# Altium schematic sheet Sensor Board.SchDoc
size 420 x 297 mm; Date: 15.01.2024; CheckedBy: Arda B; DrawnBy: Arda Bozkurt; DocumentNumber: 5; Revision: 001; SheetNumber: 5; SheetTotal: 5; Department: HDD; Size: A3
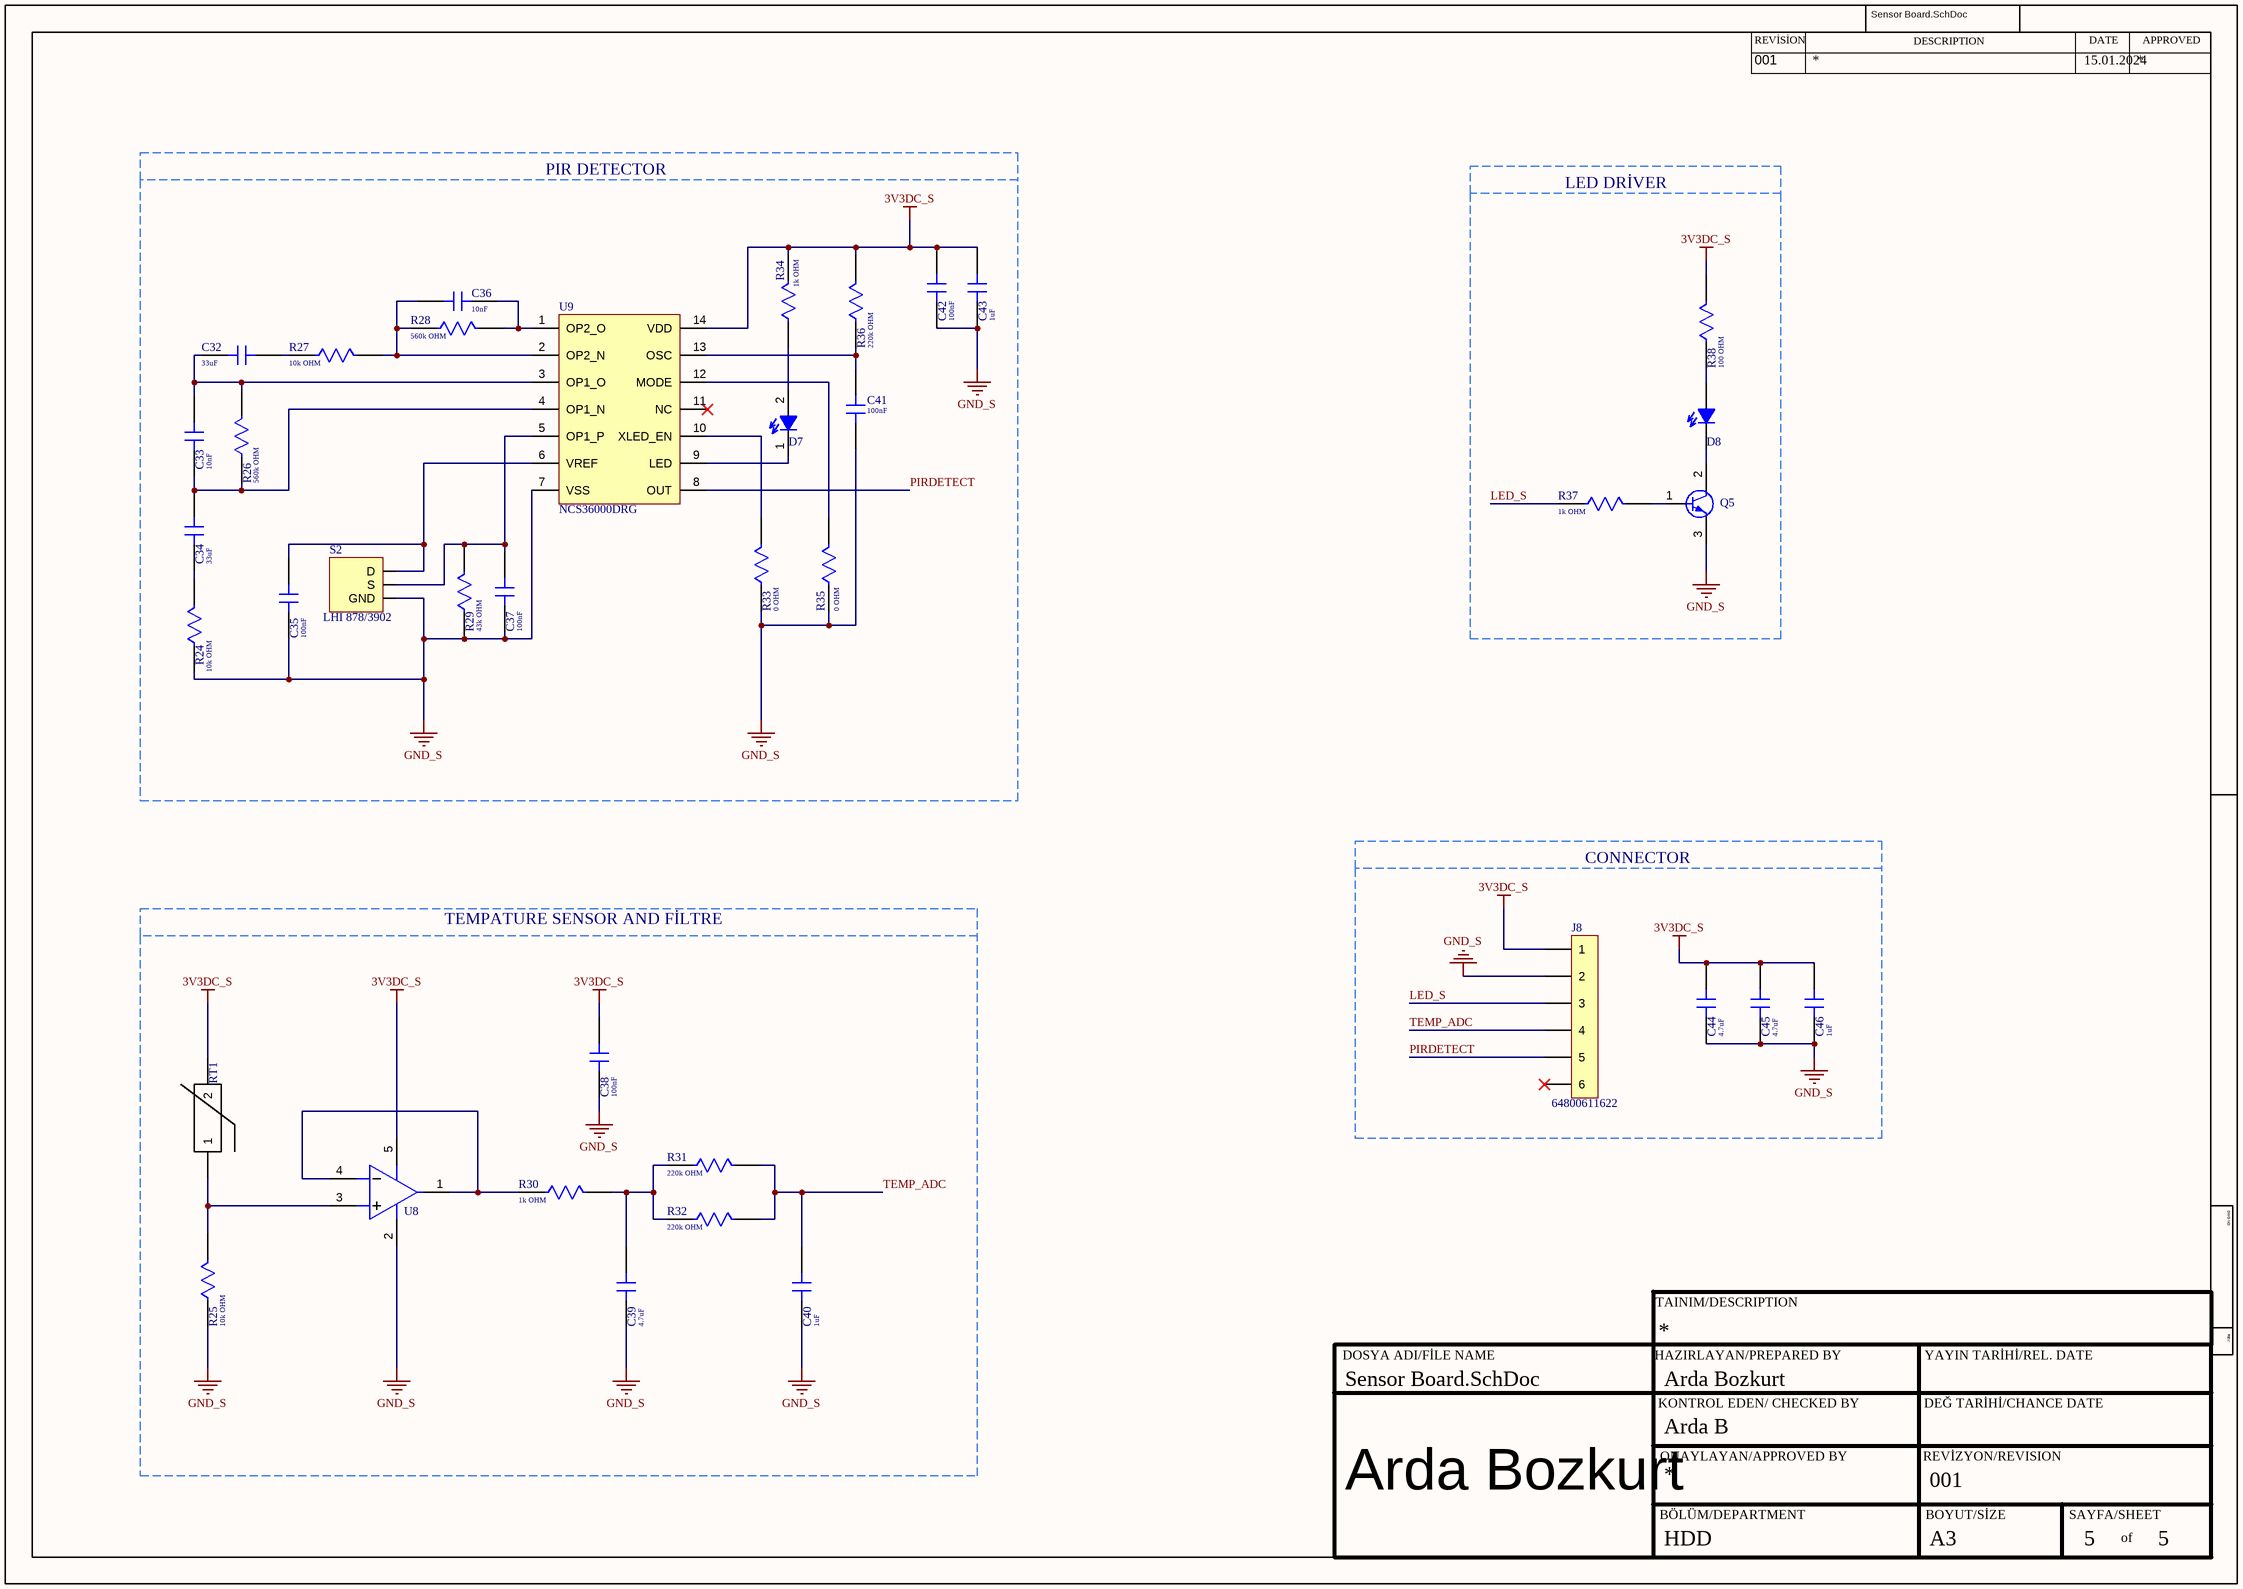
[diagram p0: Sensor Board.SchDoc]

## Parts
C32  value 33uF  [CAP 1206]  (hidden comment: C3216X5R1C336M160AB)
C33  value 10nF  [CAP-0603]  (hidden comment: 0603B103K160CT)
C34  value 33uF  [CAP 1206]  (hidden comment: C3216X5R1C336M160AB)
C35  value 100nF  [CAP-0805]  (hidden comment: 08055C104KAT2A)
C36  value 10nF  [CAP-0603]  (hidden comment: 0603B103K160CT)
C37  value 100nF  [CAP-0805]  (hidden comment: 08055C104KAT2A)
C38  value 100nF  [CAP-0603]  (hidden comment: C0603C104KRACTU)
C39  value 4.7uF  [CAP-0805]  (hidden comment: CL21A475KAQNNNE)
C40  value 1uF  [CAP-0805]  (hidden comment: CL21B105KAFNNNE)
C41  value 100nF  [CAP-0805]  (hidden comment: 08055C104KAT2A)
C42  value 100nF  [CAP-0805]  (hidden comment: 08055C104KAT2A)
C43  value 1uF  [CAP-0805]  (hidden comment: CL21B105KAFNNNE)
C44  value 4.7uF  [CAP-0805]  (hidden comment: CL21A475KAQNNNE)
C45  value 4.7uF  [CAP-0805]  (hidden comment: CL21A475KAQNNNE)
C46  value 1uF  [CAP-0805]  (hidden comment: CL21B105KAFNNNE)
D7  LTST-C171GKT  [LED GREEN 0805]  (value not drawn)
D8  LS R976-NR-1  [LED RED 0805]  (value not drawn)
J8  64800611622  [PİN_HEADER_1X6]
Q5  MMBT3904-7-F  [SOT23-3]  (value not drawn)
R24  value 10k OHM  [RES-0603]  (hidden comment: RC0603FR-0710KL)
R25  value 10k OHM  [RES-0603]  (hidden comment: RC0603FR-0710KL)
R26  value 560k OHM  [RES-0603]  (hidden comment: RMCF0603FT560K)
R27  value 10k OHM  [RES-0603]  (hidden comment: RC0603FR-0710KL)
R28  value 560k OHM  [RES-0603]  (hidden comment: RMCF0603FT560K)
R29  value 43k OHM  [RES-0603]  (hidden comment: RMCF0603FT43K0)
R30  value 1k OHM  [RES-0603]  (hidden comment: RMCF0603FT1K00)
R31  value 220k OHM  [RES-0603]  (hidden comment: WR06X2203FTL)
R32  value 220k OHM  [RES-0603]  (hidden comment: WR06X2203FTL)
R33  value 0 OHM  [RES-0603]  (hidden comment: RMCF0603ZT0R00)
R34  value 1k OHM  [RES-0603]  (hidden comment: RMCF0603FT1K00)
R35  value 0 OHM  [RES-0603]  (hidden comment: RMCF0603ZT0R00)
R36  value 220k OHM  [RES-0603]  (hidden comment: WR06X2203FTL)
R37  value 1k OHM  [RES-0603]  (hidden comment: RMCF0603FT1K00)
R38  value 100 OHM  [RES-0603]  (hidden comment: RMCF0603FT100R)
RT1  TFPT1206L1002FM  [TFPT1206]  (value not drawn)
S2  LHI 878/3902  [TO-5-3]
U8  OPA314AIDBVR  [SOT23-5]  (value not drawn)
U9  NCS36000DRG  [SOIC-14]

## Blocks framed on the sheet
PIR DETECTOR: C32-C37 C41-C43 D7 R24 R26-R29 R33-R36 S2 U9
LED DRİVER: D8 Q5 R37 R38
CONNECTOR: C44-C46 J8
TEMPATURE SENSOR AND FİLTRE: C38-C40 R25 R30-R32 RT1 U8

## Nets
3V3DC_S: C38.2 C42.2 C43.2 C44.2 C45.2 C46.2 J8.1 R34.2 R36.2 R38.2 RT1.2 U8.5(VCC+) U9.14(VDD)
GND_S: C35.1 C37.1 C38.1 C39.1 C40.1 C41.1 C42.1 C43.1 C44.1 C45.1 C46.1 J8.2 Q5.3(E) R24.1 R25.1 R29.1 R33.1 R35.1 S2.3(GND) U8.2(VCC-) U9.7(VSS)
LED_S: J8.3 R37.1
PIRDETECT: J8.5 U9.8(OUT)
TEMP_ADC: C40.2 J8.4 R31.2 R32.2
NetC32_1: C32.1 C33.2 R26.2 U9.3(OP1_O)
NetC32_2: C32.2 R27.1
NetC33_1: C33.1 C34.2 R26.1 U9.4(OP1_N)
NetC34_1: C34.1 R24.2
NetC35_2: C35.2 S2.1(D) U9.6(VREF)
NetC36_1: C36.1 R27.2 R28.1 U9.2(OP2_N)
NetC36_2: C36.2 R28.2 U9.1(OP2_O)
NetC37_2: C37.2 R29.2 S2.2(S) U9.5(OP1_P)
NetC39_2: C39.2 R30.2 R31.1 R32.1
NetC41_2: C41.2 R36.1 U9.13(OSC)
NetD7_1: D7.1 U9.9(LED)
NetD7_2: D7.2 R34.1
NetD8_1: D8.1 Q5.2(C)
NetD8_2: D8.2 R38.1
NetQ5_1: Q5.1(B) R37.2
NetR25_2: R25.2 RT1.1 U8.3(IN+)
NetR30_1: R30.1 U8.1(OUT) U8.4(IN-)
NetR33_2: R33.2 U9.10(XLED_EN)
NetR35_2: R35.2 U9.12(MODE)

Not connected (* = marked no-connect by the designer): J8 6*; U9 11(NC)*

## Notes on the sheet
- REVİSİON
- DESCRIPTION
- DATE
- APPROVED
- DWG NO:
- TAINIM/DESCRIPTION
- REV:
- DOSYA ADI/FİLE NAME
- HAZIRLAYAN/PREPARED BY
- KONTROL EDEN/ CHECKED BY
- YAYIN TARİHİ/REL. DATE
- DEĞ TARİHİ/CHANCE DATE
- ONAYLAYAN/APPROVED BY
- REVİZYON/REVISION
- Arda Bozkurt
- BÖLÜM/DEPARTMENT
- BOYUT/SİZE
- SAYFA/SHEET
- of

## Library data of the parts
C32 C34 = CAP CER 33uF 1206: C Series 1206 33 uF 16 V ±20 % Tolerance X5R SMT Multilayer Ceramic Capacitor; Manufacturer: TDK; Material: 4241ConductorMaterial; Tolerance: 20%; Voltage Rating (DC): 16V; Designed By.: Arda B.; Supplier: Digi-Key; Supplier Part Number: 445-6002-1-ND; Manufacturer Part Number: C3216X5R1C336M160AB; RoHS: Yes; Category: Ceramic Capacitors; Stock: 80093; Pricing: 1=0,97, 10=0,7, 50=0,6118, 100=0,4985, 500=0,40788, 1000=0,35123 (USD); Mounting Technology: Surface Mount; Case/Package: 1206; Dielectric Material: Ceramic; Case Code (Metric): 3216; Case Code (Imperial): 1206; Weight: 0.000571oz; Min Operating Temperature: -55°C; Max Operating Temperature: 85°C; Packaging: Tape and Reel; Dielectric: X5R; Package Quantity: 2000; Voltage Rating: 16V; Termination: SMD/SMT; Series: C; Construction: Flat; Length: 3.2mm; Width: 1.6mm; Height: 1.6mm; Depth: 1.6mm; Radiation Hardening: No; Reach SVHC Compliant: No; Lead Free: Lead Free; RoHS Compliant: Yes; ComponentLink1URL: https://datasheet.ciiva.com/24219/c3216x5r1c336m160ab-265284-24219738.pdf?src-supplier=Mouser; ComponentLink1Description: https://datasheet.ciiva.com/24219/c3216x5r1c336m160ab-265284-24219738.pdf?src-supplier=Mouser; ComponentLink2URL: https://datasheet.ciiva.com/15192/getdatasheetpartid-714446-15192221.pdf?src-supplier=Verical; ComponentLink2Description: https://datasheet.ciiva.com/15192/getdatasheetpartid-714446-15192221.pdf?src-supplier=Verical; ComponentLink3URL: https://datasheet.ciiva.com/6285/tdkmlcccaprange-6285581.pdf?src-supplier=Digi-Key; ComponentLink3Description: https://datasheet.ciiva.com/6285/tdkmlcccaprange-6285581.pdf?src-supplier=Digi-Key; ComponentLink4URL: https://datasheet.ciiva.com/6285/tdkmlcccaprange-6285578.pdf?src-supplier=Digi-Key; ComponentLink4Description: https://datasheet.ciiva.com/6285/tdkmlcccaprange-6285578.pdf?src-supplier=Digi-Key; ComponentLink5URL: https://datasheet.ciiva.com/6285/tdkmlcccaprange-6285583.pdf?src-supplier=Digi-Key; ComponentLink5Description: https://datasheet.ciiva.com/6285/tdkmlcccaprange-6285583.pdf?src-supplier=Digi-Key
C33 C36 = CAP CER 10nF 0603: 0603 16V X7R .01uF 10% multilayer ceramic capacitor; Manufacturer: Walsin Technologies; Designed By: Arda B.; Supplier: Digi-Key; Supplier Part Number: 1292-1384-1-ND; Manufacturer Part Number: 0603B103K160CT; RoHS: Yes; Category: Ceramic Capacitors; Stock: 116602; Pricing: 1=0,1, 10=0,032, 50=0,0182, 100=0,0141, 500=0,0106, 1000=0,00833 (USD); Lead Free: 5697LeadFree; ComponentLink1URL: http://www.farnell.com/datasheets/1958513.pdf?src-supplier=Farnell; ComponentLink1Description: http://www.farnell.com/datasheets/1958513.pdf?src-supplier=Farnell; ComponentLink2URL: http://www.passivecomponent.com/wp-content/uploads/2018/10/MLCC.pdf?src-supplier=Digi-Key; ComponentLink2Description: http://www.passivecomponent.com/wp-content/uploads/2018/10/MLCC.pdf?src-supplier=Digi-Key; ComponentLink3URL: https://datasheet.octopart.com/0603B103K160CT-Walsin-Technologies-datasheet-85392065.pdf?src-supplier=Element14; ComponentLink3Description: https://datasheet.octopart.com/0603B103K160CT-Walsin-Technologies-datasheet-85392065.pdf?src-supplier=Element14; ComponentLink4URL: https://datasheet.octopart.com/0603B103K160CT-Walsin-Technologies-datasheet-136037192.pdf?src-supplier=Future+Electronics; ComponentLink4Description: https://datasheet.octopart.com/0603B103K160CT-Walsin-Technologies-datasheet-136037192.pdf?src-supplier=Future+Electronics; ComponentLink5URL: https://datasheet.octopart.com/0603B103K160CT-Walsin-Technologies-datasheet-62066062.pdf?src-supplier=TME; ComponentLink5Description: https://datasheet.octopart.com/0603B103K160CT-Walsin-Technologies-datasheet-62066062.pdf?src-supplier=TME
C35 C37 C41 C42 = CAP CER 100nF 0805: Multilayer Ceramic Capacitor, 0.1 uF, 50 V, ± 10%, X7R, 0805 [2012 Metric]; Manufacturer: Kyocera AVX; Designed By: Arda B.; Material: 4241ConductorMaterial; Voltage Rating (DC): 50V; Supplier: Arrow Electronics; Supplier Part Number: 08055C104KAT2A; Manufacturer Part Number: 08055C104KAT2A; RoHS: Yes; Category: Ceramic Capacitors; Stock: 4448000; Pricing: 4000=0,0139, 8000=0,0127, 12000=0,0121, 20000=0,012, 24000=0,0115, 100000=0,0076 (USD); Case/Package: 0805; Case Code (Metric): 2012; Case Code (Imperial): 0805; Dielectric Material: Ceramic; Weight: 0.001411oz; Min Operating Temperature: -55°C; Max Operating Temperature: 125°C; Tolerance: 10%; Dielectric: X7R; Packaging: Cut Tape; Package Quantity: 4000; Termination: Standard; Voltage: 50V; Series: MLCC X7R; Voltage Rating (AC): 50V; Length: 2mm; Width: 1.2mm; Height: 0.5mm; Lead Free: Lead Free; RoHS Compliant: Yes; ComponentLink1URL: https://datasheet.ciiva.com/19475/2009691-19475858.pdf?src-supplier=Jameco; ComponentLink1Description: https://datasheet.ciiva.com/19475/2009691-19475858.pdf?src-supplier=Jameco; ComponentLink2URL: https://datasheet.ciiva.com/11786/0900766b802d4698-11786116.pdf?src-supplier=Rs; ComponentLink2Description: https://datasheet.ciiva.com/11786/0900766b802d4698-11786116.pdf?src-supplier=Rs; ComponentLink3URL: https://datasheet.ciiva.com/5416/cx7r-5416959.pdf?src-supplier=Mouser; ComponentLink3Description: https://datasheet.ciiva.com/5416/cx7r-5416959.pdf?src-supplier=Mouser; ComponentLink4URL: https://datasheet.ciiva.com/2988/cx7r-2988014.pdf?src-supplier=Avnet; ComponentLink4Description: https://datasheet.ciiva.com/2988/cx7r-2988014.pdf?src-supplier=Avnet; ComponentLink5URL: https://datasheet.ciiva.com/16199/cx7r-16199014.pdf?src-supplier=Future+Electronics; ComponentLink5Description: https://datasheet.ciiva.com/16199/cx7r-16199014.pdf?src-supplier=Future+Electronics; ComponentLink6URL: https://datasheet.ciiva.com/11504/cx7r-11504044.pdf?src-supplier=Avnet; ComponentLink6Description: https://datasheet.ciiva.com/11504/cx7r-11504044.pdf?src-supplier=Avnet; ComponentLink7URL: https://datasheet.ciiva.com/150/cx7r-150258.pdf?src-supplier=Digi-Key; ComponentLink7Description: https://datasheet.ciiva.com/150/cx7r-150258.pdf?src-supplier=Digi-Key; ComponentLink8URL: https://datasheet.ciiva.com/150/cx7r-150257.pdf?src-supplier=Digi-Key; ComponentLink8Description: https://datasheet.ciiva.com/150/cx7r-150257.pdf?src-supplier=Digi-Key; ComponentLink9URL: https://datasheet.ciiva.com/150/cx7r-150259.pdf?src-supplier=Digi-Key; ComponentLink9Description: https://datasheet.ciiva.com/150/cx7r-150259.pdf?src-supplier=Digi-Key; ComponentLink10URL: https://datasheet.ciiva.com/7812/cx7r-7812079.pdf?src-supplier=Element14; ComponentLink10Description: https://datasheet.ciiva.com/7812/cx7r-7812079.pdf?src-supplier=Element14
C38 = CAP CER 100nF 0603: Capacitor, 0.1UF, 100V, MLCC, 0603;; Manufacturer: KEMET; Manufacturer Part Number: C0603C104K1RACTU; Dielectric: 1511DielectricType; Designed By: Arda B.; Supplier: Digi-Key; Supplier Part Number: 399-C0603C104K1RACTUCT-ND; RoHS: No; Category: Ceramic Capacitors; Stock: 4405; Pricing: 1=0,28, 10=0,185, 50=0,1296, 100=0,1047, 500=0,07782, 1000=0,06808 (USD); Case/Package: 345Case; Voltage Rating (DC): 100V
C39 C44 C45 = CAP CER 4.7uF 0805: Multilayer Ceramic Capacitor, 4.7 uF, 25 V, ± 10%, X5R, 0805 [2012 Metric]; Manufacturer: Samsung; Voltage Rating: 25V; Designed By: Arda B.; Supplier: Digi-Key; Supplier Part Number: 1276-1244-1-ND; Manufacturer Part Number: CL21A475KAQNNNE; RoHS: Yes; Category: Ceramic Capacitors; Stock: 3410220; Pricing: 1=0,1, 10=0,069, 50=0,0414, 100=0,0326, 500=0,02408, 1000=0,01994 (USD); Mounting Technology: Surface Mount; Case/Package: 0805; Case Code (Metric): 2012; Case Code (Imperial): 0805; Material: Ceramic; Min Operating Temperature: -55°C; Max Operating Temperature: 85°C; Packaging: Tape and Reel; Tolerance: 10%; Dielectric: X5R; Voltage Rating (DC): 25V; Series: CL; Construction: Flat; Length: 2mm; Height: 1.25mm; Depth: 1.25mm; Radiation Hardening: No; Lead Free: Lead Free; RoHS Compliant: Yes; ComponentLink1URL: https://datasheet.ciiva.com/25798/cl21a475kaqnnne-25798882.pdf?src-supplier=Digi-Key; ComponentLink1Description: https://datasheet.ciiva.com/25798/cl21a475kaqnnne-25798882.pdf?src-supplier=Digi-Key
C40 C43 C46 = CAP CER 1uF 0805: Multilayer Ceramic Capacitor, 1 uF, 25 V, ± 10%, X7R, 0805 [2012 Metric]; Manufacturer: Samsung; Voltage: 25V; Designed By: Arda B.; Supplier: Digi-Key; Supplier Part Number: 1276-1066-6-ND; Manufacturer Part Number: CL21B105KAFNNNE; RoHS: Yes; Category: Ceramic Capacitors; Stock: 1108684; Pricing: 1=0,1, 10=0,062, 50=0,0356, 100=0,0276, 500=0,02078, 1000=0,01633 (USD); Mounting Technology: Surface Mount; Case/Package: 0805; Case Code (Metric): 2012; Case Code (Imperial): 0805; Min Operating Temperature: -55°C; Max Operating Temperature: 125°C; Tolerance: 10%; Dielectric: X7R; Voltage Rating (DC): 25V; Series: CL; Packaging: Tape and Reel; Voltage Rating: 25V; Package Quantity: 1; Construction: Flat; Length: 2mm; Width: 0.049inch; Height: 1.25mm; Depth: 1.25mm; Thickness: 0.053inch; Radiation Hardening: No; Lead Free: Lead Free; RoHS Compliant: Yes; ComponentLink1URL: https://datasheet.ciiva.com/25800/cl21b105kafnnne-25800163.pdf?src-supplier=Digi-Key; ComponentLink1Description: https://datasheet.ciiva.com/25800/cl21b105kafnnne-25800163.pdf?src-supplier=Digi-Key; ComponentLink2URL: https://datasheet.ciiva.com/15195/getdatasheetpartid-355205-15195880.pdf?src-supplier=Verical; ComponentLink2Description: https://datasheet.ciiva.com/15195/getdatasheetpartid-355205-15195880.pdf?src-supplier=Verical
D7 = LED GREEN 0805: LED Low-Power Uni-Color Green 565nm 2.1V 2-Pin Chip LED T/R; Manufacturer: Vishay Lite-On; Designed By: Arda B.; Lens Color: Colorless; Viewing Angle: 130°; Lens Style: Flat,Diffused,Colorless,Rectangular,Clear; Luminous Intensity: 12mcd; Forward Current: 30mA; Power Rating: 100mW; Dominant Wavelength: 569nm; Test Current: 10mA; Lens Transparency: Clear; Number of Elements: 1; Reverse Voltage: 5V; Lens Size: 1.25mm; Supplier: Digi-Key; Supplier Part Number: 160-1423-1-ND; Manufacturer Part Number: LTST-C171GKT; RoHS: Yes; Category: LEDs; Stock: 371262; Pricing: 1=0,25, 10=0,136, 100=0,063, 500=0,05818, 1000=0,04557 (USD); Mounting Technology: Surface Mount; Case/Package: 0805; Pins: 2; Color: Green; Case Code (Metric): 2012; Case Code (Imperial): 0805; Min Operating Temperature: -55°C; Max Operating Temperature: 85°C; Package Quantity: 3000; Packaging: Tape and Reel; Forward Voltage: 2.1V; Illumination Color: Green; Power Dissipation: 100mW; Wavelength: 565nm; Number of LEDs: 1; Series: -; Length: 2mm; Width: 1.25mm; Height: 0.9mm; Depth: 1.25mm; Radiation Hardening: No; Lead Free: Lead Free; RoHS Compliant: Yes; ComponentLink1URL: https://datasheet.ciiva.com/2110/ltst-c171gkt-2110000.pdf?src-supplier=Digi-Key; ComponentLink1Description: https://datasheet.ciiva.com/2110/ltst-c171gkt-2110000.pdf?src-supplier=Digi-Key; ComponentLink2URL: https://datasheet.ciiva.com/11773/0900766b80dc0296-11773991.pdf?src-supplier=Rs; ComponentLink2Description: https://datasheet.ciiva.com/11773/0900766b80dc0296-11773991.pdf?src-supplier=Rs; ComponentLink3URL: https://datasheet.ciiva.com/12400/lite-on-ltst-c171gkt-190133-12400647.pdf?src-supplier=Mouser; ComponentLink3Description: https://datasheet.ciiva.com/12400/lite-on-ltst-c171gkt-190133-12400647.pdf?src-supplier=Mouser; ComponentLink4URL: https://datasheet.ciiva.com/2110/ltst-c171gkt-2110001.pdf?src-supplier=Digi-Key; ComponentLink4Description: https://datasheet.ciiva.com/2110/ltst-c171gkt-2110001.pdf?src-supplier=Digi-Key; ComponentLink5URL: https://datasheet.ciiva.com/2110/ltst-c171gkt-2110002.pdf?src-supplier=Digi-Key; ComponentLink5Description: https://datasheet.ciiva.com/2110/ltst-c171gkt-2110002.pdf?src-supplier=Digi-Key; ComponentLink6URL: https://datasheet.ciiva.com/16396/ltst-c171gkt-16396549.pdf?src-supplier=Future+Electronics; ComponentLink6Description: https://datasheet.ciiva.com/16396/ltst-c171gkt-16396549.pdf?src-supplier=Future+Electronics
D8 = LED RED 0805: LED Uni-Color Super Red 645nm 2-Pin Chip 0805(2012Metric) T/R; Manufacturer: Osram Opto; Designed By: Arda B.; Lens Color: White; Viewing Angle: 160°; Lens Style: Flat,Diffused,Colorless,Rectangular; Dominant Wavelength: 633nm; Luminous Flux: 0.47lm; Number of LEDs: 1; Forward Current: 25mA; Forward Voltage: 2.5V; Luminous Intensity: 180mcd; Test Current: 20mA; Power Dissipation: 65mW; Reverse Voltage: 12V; Lens Transparency: Diffused; Lens Size: 1.25mm; Supplier: Digi-Key; Supplier Part Number: 475-LSR976-NR-1CT-ND; Manufacturer Part Number: LSR976-NR-1; RoHS: Yes; Category: LEDs; Stock: 164692; Pricing: 1=0,27, 10=0,147, 100=0,0683, 500=0,06302, 1000=0,04937, 2000=0,04832 (USD); Mounting Technology: Surface Mount; Case/Package: 0805; Pins: 2; Color: Red; Case Code (Metric): 2012; Case Code (Imperial): 0805; Min Operating Temperature: -30°C; Max Operating Temperature: 85°C; Packaging: Tape and Reel; Illumination Color: Red; Package Quantity: 16000; Number of Elements: 1; Series: CHIPLED 0805; Wavelength: 633nm; Length: 2.1mm; Width: 1.25mm; Height: 0.9mm; Depth: 1.35mm; Radiation Hardening: No; RoHS Compliant: Yes; ComponentLink1URL: https://datasheet.ciiva.com/4688/o-ls-ly-r976-24152-4688435.pdf?src-supplier=Mouser; ComponentLink1Description: https://datasheet.ciiva.com/4688/o-ls-ly-r976-24152-4688435.pdf?src-supplier=Mouser; ComponentLink2URL: https://datasheet.ciiva.com/26920/getdatasheetpartid-568367-26920831.pdf?src-supplier=Verical; ComponentLink2Description: https://datasheet.ciiva.com/26920/getdatasheetpartid-568367-26920831.pdf?src-supplier=Verical; ComponentLink3URL: https://datasheet.ciiva.com/2112/00078896-0-2112782.pdf?src-supplier=Digi-Key; ComponentLink3Description: https://datasheet.ciiva.com/2112/00078896-0-2112782.pdf?src-supplier=Digi-Key; ComponentLink4URL: https://datasheet.ciiva.com/2112/00078896-0-2112781.pdf?src-supplier=Digi-Key; ComponentLink4Description: https://datasheet.ciiva.com/2112/00078896-0-2112781.pdf?src-supplier=Digi-Key; ComponentLink5URL: https://datasheet.ciiva.com/2112/00078896-0-2112783.pdf?src-supplier=Digi-Key; ComponentLink5Description: https://datasheet.ciiva.com/2112/00078896-0-2112783.pdf?src-supplier=Digi-Key
J8 = PİN HEADER 1X6: WR-WTB Wire-to-Board Connectors 1.50 mm; Manufacturer: Wurth Electronics; Designed By.: Arda B.; Supplier: Digi-Key; Supplier Part Number: 732-64800611622-ND; Manufacturer Part Number: 64800611622; RoHS: No; Category: Uncategorized; Stock: 544; Pricing: 1=0,42, 50=0,406, 100=0,384, 250=0,361, 500=0,339 (USD)
Q5 = MMBT3904-7-F: Transistor General Purpose BJT NPN 40 Volt 0.2A Automotive 3-Pin SOT-23; Manufacturer: Diodes Zetex; Designed By: Arda B.; Max Power Dissipation: 300mW; Collector Emitter Voltage (VCEO): 40V; Max Collector Current: 200mA; Collector Base Voltage (VCBO): 60V; Power Dissipation: 350mW; Frequency: 300MHz; hFE Min: 100; Number of Elements: 1; Emitter Base Voltage (VEBO): 6V; Collector Emitter Saturation Voltage: 300mV; Supplier: Digi-Key; Supplier Part Number: MMBT3904-FDICT-ND; Manufacturer Part Number: MMBT3904-7-F; RoHS: Yes; Category: BJTs; Stock: 5390800; Pricing: 1=0,12, 10=0,086, 100=0,0467, 500=0,03666, 1000=0,02545 (USD); Mounting Technology: Surface Mount; Case/Package: SOT-23; Pins: 3; Weight: 0.000282oz; Min Operating Temperature: -55°C; Max Operating Temperature: 150°C; Polarity: NPN; Packaging: Tape and Reel; Package Quantity: 3000; Transition Frequency: 300MHz; Collector Emitter Breakdown Voltage: 40V; Max Breakdown Voltage: 40V; Continuous Collector Current: 200mA; Clock Frequency: 300MHz; Gain Bandwidth Product: 300MHz; Voltage Rating (DC): 40V; Series: Automotive, AEC-Q101; Collector-emitter Voltage-Max: 300mV; Length: 3.05mm; Width: 1.4mm; Height: 1mm; Radiation Hardening: No; Reach SVHC Compliant: No; Lead Free: Lead Free; RoHS Compliant: Yes; ComponentLink1URL: https://datasheet.ciiva.com/11201/ds30036-11201778.pdf?src-supplier=Avnet; ComponentLink1Description: https://datasheet.ciiva.com/11201/ds30036-11201778.pdf?src-supplier=Avnet; ComponentLink2URL: https://datasheet.ciiva.com/15138/getdatasheetpartid-53265-15138780.pdf?src-supplier=Verical; ComponentLink2Description: https://datasheet.ciiva.com/15138/getdatasheetpartid-53265-15138780.pdf?src-supplier=Verical; ComponentLink3URL: https://datasheet.ciiva.com/22711/1915516-22711750.pdf?src-supplier=Element14; ComponentLink3Description: https://datasheet.ciiva.com/22711/1915516-22711750.pdf?src-supplier=Element14; ComponentLink4URL: https://datasheet.ciiva.com/11198/ds30036-11198999.pdf?src-supplier=Avnet; ComponentLink4Description: https://datasheet.ciiva.com/11198/ds30036-11198999.pdf?src-supplier=Avnet; ComponentLink5URL: https://datasheet.ciiva.com/6361/ds30036-6361256.pdf?src-supplier=Digi-Key; ComponentLink5Description: https://datasheet.ciiva.com/6361/ds30036-6361256.pdf?src-supplier=Digi-Key; ComponentLink6URL: https://datasheet.ciiva.com/6361/ds30036-6361254.pdf?src-supplier=Digi-Key; ComponentLink6Description: https://datasheet.ciiva.com/6361/ds30036-6361254.pdf?src-supplier=Digi-Key
R24 R25 R27 = RES 10K OHM 0603: SMD Chip Resistor, 10 kOhm, ± 1%, 100 mW, 0603 [1608 Metric], Thick Film, General Purpose; Manufacturer: Yageo; Voltage Rating (DC): 50V; Temperature Coefficient: 100ppm/°C; Power Rating: 100mW; Voltage Rating: 75V; Designed By: Arda B.; Supplier: Digi-Key; Supplier Part Number: 311-10.0KHRCT-ND; Manufacturer Part Number: RC0603FR-0710KL; RoHS: Yes; Category: Chip SMD Resistors; Stock: 24703208; Pricing: 1=0,1, 10=0,019, 50=0,0112, 100=0,0093, 500=0,00622, 1000=0,00532 (USD); Case/Package: 0603; Pins: 2; Case Code (Imperial): 0603; Case Code (Metric): 1608; Weight: 7.1E-05oz; Min Operating Temperature: -55°C; Max Operating Temperature: 155°C; Tolerance: 1%; Resistor Type: Thick Film; Packaging: Tape and Reel; Termination: SMD/SMT; Features: Moisture Resistant; Series: RC; Max Power Dissipation: 100mW; Number of Terminations: 2; Resistance Tolerance: 1%; Construction: Rectangular; Length: 1.6mm; Width: 0.8mm; Height: 0.45mm; Depth: 0.8mm; Lead Pitch: 0.3mm; Reach SVHC Compliant: No; Lead Free: 5697LeadFree; Military Standard: Not; RoHS Compliant: Yes; ComponentLink1URL: https://datasheet.ciiva.com/7660/38590-7660789.pdf?src-supplier=Element14; ComponentLink1Description: https://datasheet.ciiva.com/7660/38590-7660789.pdf?src-supplier=Element14; ComponentLink2URL: https://datasheet.ciiva.com/7983/443971-7983596.pdf?src-supplier=Element14; ComponentLink2Description: https://datasheet.ciiva.com/7983/443971-7983596.pdf?src-supplier=Element14; ComponentLink3URL: https://datasheet.ciiva.com/22747/443971-22747519.pdf?src-supplier=Element14; ComponentLink3Description: https://datasheet.ciiva.com/22747/443971-22747519.pdf?src-supplier=Element14; ComponentLink4URL: https://datasheet.ciiva.com/46440/1868787-46440891.pdf?src-supplier=Element14; ComponentLink4Description: https://datasheet.ciiva.com/46440/1868787-46440891.pdf?src-supplier=Element14; ComponentLink5URL: https://datasheet.ciiva.com/7746/1738695-7746239.pdf?src-supplier=Element14; ComponentLink5Description: https://datasheet.ciiva.com/7746/1738695-7746239.pdf?src-supplier=Element14; ComponentLink6URL: https://datasheet.ciiva.com/15189/getdatasheetpartid-409289-15189591.pdf?src-supplier=Verical; ComponentLink6Description: https://datasheet.ciiva.com/15189/getdatasheetpartid-409289-15189591.pdf?src-supplier=Verical
R26 R28 = RES 560K OHM 0603: Res Thick Film 0603 560K Ohm 1% 1/10W ±100ppm/°C Molded SMD SMD Paper T/R; Manufacturer: Stackpole Electronics; Designed By: Arda B.; Max Power Dissipation: 100mW; Voltage Rating: 75V; Supplier: Digi-Key; Supplier Part Number: RMCF0603FT560KCT-ND; Manufacturer Part Number: RMCF0603FT560K; RoHS: Yes; Category: Chip SMD Resistors; Stock: 107718; Pricing: 1=0,1, 10=0,015, 50=0,009, 100=0,0075, 500=0,00498, 1000=0,00425 (USD); Mounting Technology: Surface Mount; Case/Package: 0603; Case Code (Metric): 1608; Case Code (Imperial): 0603; Contact Plating: Tin,Matte; Min Operating Temperature: -55°C; Max Operating Temperature: 155°C; Tolerance: 1%; Packaging: Tape and Reel; Number of Terminations: 2; Temperature Coefficient: 100ppm/°C; Features: Automotive AEC-Q200; Series: RMCF; Length: 0.061inch; Width: 0.031inch; Height: 0.022inch; Radiation Hardening: No; Lead Free: Lead Free; RoHS Compliant: Yes; ComponentLink1URL: https://www.seielect.com/Catalog/SEI-RMCF_RMCP.pdf?src-supplier=Digi-Key; ComponentLink1Description: https://www.seielect.com/Catalog/SEI-RMCF_RMCP.pdf?src-supplier=Digi-Key; ComponentLink2URL: https://www.seielect.com/catalog/SEI-Packaging.pdf?src-supplier=Digi-Key; ComponentLink2Description: https://www.seielect.com/catalog/SEI-Packaging.pdf?src-supplier=Digi-Key; ComponentLink3URL: https://www.seielect.com/catalog/SEI-RMCF_RMCP.pdf?src-supplier=Avnet; ComponentLink3Description: https://www.seielect.com/catalog/SEI-RMCF_RMCP.pdf?src-supplier=Avnet
R29 = RES 43K OHM 0603: Res Thick Film 0603 43K Ohm 1% 1/10W ±100ppm/°C Molded SMD SMD Paper T/R; Manufacturer: Stackpole Electronics; Designed By: Arda B.; Max Power Dissipation: 100mW; Voltage Rating: 75V; Supplier: Digi-Key; Supplier Part Number: RMCF0603FT43K0CT-ND; Manufacturer Part Number: RMCF0603FT43K0; RoHS: Yes; Category: Chip SMD Resistors; Stock: 161381; Pricing: 1=0,1, 10=0,015, 50=0,009, 100=0,0075, 500=0,00498, 1000=0,00425 (USD); Mounting Technology: Surface Mount; Case/Package: 0603; Case Code (Metric): 1608; Case Code (Imperial): 0603; Contact Plating: Tin,Matte; Min Operating Temperature: -55°C; Max Operating Temperature: 155°C; Tolerance: 1%; Packaging: Tape and Reel; Number of Terminations: 2; Temperature Coefficient: 100ppm/°C; Features: Automotive AEC-Q200; Series: RMCF; Construction: Rectangular; Length: 0.061inch; Width: 0.031inch; Height: 0.022inch; Depth: 0.8mm; Radiation Hardening: No; Military Standard: Not; Lead Free: Lead Free; RoHS Compliant: Yes; ComponentLink1URL: https://www.seielect.com/Catalog/SEI-RMCF_RMCP.pdf?src-supplier=Digi-Key; ComponentLink1Description: https://www.seielect.com/Catalog/SEI-RMCF_RMCP.pdf?src-supplier=Digi-Key; ComponentLink2URL: https://www.seielect.com/catalog/SEI-Packaging.pdf?src-supplier=Digi-Key; ComponentLink2Description: https://www.seielect.com/catalog/SEI-Packaging.pdf?src-supplier=Digi-Key; ComponentLink3URL: https://www.seielect.com/catalog/SEI-RMCF_RMCP.pdf?src-supplier=Avnet; ComponentLink3Description: https://www.seielect.com/catalog/SEI-RMCF_RMCP.pdf?src-supplier=Avnet; ComponentLink4URL: http://components.arrow.com/part/dataview/50496990S50295N1174?src-supplier=Arrow+Electronics; ComponentLink4Description: http://components.arrow.com/part/dataview/50496990S50295N1174?src-supplier=Arrow+Electronics
R30 R34 R37 = RES 1K OHM 0603: Res Thick Film 0603 1K Ohm 1% 0.1W(1/10W) ±100ppm/C Pad SMD Automotive T/R; Manufacturer: Stackpole Electronics; Designed By: Arda B.; Power Rating: 100mW; Temperature Coefficient: 100ppm/°C; Voltage Rating: 75V; Supplier: Digi-Key; Supplier Part Number: RMCF0603FT1K00CT-ND; Manufacturer Part Number: RMCF0603FT1K00; RoHS: Yes; Category: Chip SMD Resistors; Stock: 2889922; Pricing: 1=0,1, 10=0,015, 50=0,009, 100=0,0075, 500=0,00498, 1000=0,00425 (USD); Mounting Technology: Surface Mount; Case/Package: 0603; Case Code (Metric): 1608; Case Code (Imperial): 0603; Contact Plating: Tin,Matte; Min Operating Temperature: -55°C; Max Operating Temperature: 155°C; Tolerance: 1%; Packaging: Tape and Reel; Number of Terminations: 2; Max Power Dissipation: 100mW; Features: Automotive AEC-Q200; Series: RMCF; Construction: Rectangular; Length: 1.55mm; Width: 0.031inch; Height: 0.022inch; Depth: 0.8mm; Radiation Hardening: No; Military Standard: Not; Lead Free: Lead Free; RoHS Compliant: Yes; ComponentLink1URL: https://datasheet.octopart.com/RMCF0603FT1K00-Stackpole-Electronics-datasheet-11547379.pdf?src-supplier=Future+Electronics; ComponentLink1Description: https://datasheet.octopart.com/RMCF0603FT1K00-Stackpole-Electronics-datasheet-11547379.pdf?src-supplier=Future+Electronics; ComponentLink2URL: https://www.seielect.com/catalog/SEI-Packaging.pdf?src-supplier=Avnet; ComponentLink2Description: https://www.seielect.com/catalog/SEI-Packaging.pdf?src-supplier=Avnet; ComponentLink3URL: https://www.seielect.com/catalog/SEI-Packaging.pdf?src-supplier=Arrow+Electronics; ComponentLink3Description: https://www.seielect.com/catalog/SEI-Packaging.pdf?src-supplier=Arrow+Electronics; ComponentLink4URL: http://www.seielect.com/Catalog/SEI-rmc.pdf?src-supplier=Future+Electronics; ComponentLink4Description: http://www.seielect.com/Catalog/SEI-rmc.pdf?src-supplier=Future+Electronics; ComponentLink5URL: https://www.seielect.com/catalog/SEI-Packaging.pdf?src-supplier=Verical; ComponentLink5Description: https://www.seielect.com/catalog/SEI-Packaging.pdf?src-supplier=Verical; ComponentLink6URL: https://www.seielect.com/catalog/SEI-RMCF_RMCP.pdf?src-supplier=Avnet; ComponentLink6Description: https://www.seielect.com/catalog/SEI-RMCF_RMCP.pdf?src-supplier=Avnet; ComponentLink7URL: https://www.seielect.com/catalog/sei-rmcf_rmcp.pdf?src-supplier=Digi-Key; ComponentLink7Description: https://www.seielect.com/catalog/sei-rmcf_rmcp.pdf?src-supplier=Digi-Key; ComponentLink8URL: https://www.seielect.com/catalog/SEI-Packaging.pdf?src-supplier=Quest; ComponentLink8Description: https://www.seielect.com/catalog/SEI-Packaging.pdf?src-supplier=Quest; ComponentLink9URL: https://datasheet.octopart.com/RMCF0603FT1K00-Stackpole-Electronics-datasheet-155966809.pdf?src-supplier=Master+Electronics; ComponentLink9Description: https://datasheet.octopart.com/RMCF0603FT1K00-Stackpole-Electronics-datasheet-155966809.pdf?src-supplier=Master+Electronics
R31 R32 R36 = RES 220K OHM 0603: Res Thick Film 0603 220K Ohm 1% 0.1W(1/10W) ±100ppm/C Pad SMD T/R; Manufacturer: Walsin Technologies; Designed By: Arda B.; Supplier: Digi-Key; Supplier Part Number: 1292-WR06X2203FTLCT-ND; Manufacturer Part Number: WR06X2203FTL; RoHS: Yes; Category: Chip SMD Resistors; Stock: 211769; Pricing: 1=0,1, 10=0,017, 50=0,0096, 100=0,0077, 500=0,00488, 1000=0,00411 (USD); ComponentLink1URL: http://www.farnell.com/datasheets/1960319.pdf?src-supplier=Farnell; ComponentLink1Description: http://www.farnell.com/datasheets/1960319.pdf?src-supplier=Farnell; ComponentLink2URL: https://datasheet.octopart.com/WR06X2203FTL-Walsin-Technologies-datasheet-48038251.pdf?src-supplier=Element14; ComponentLink2Description: https://datasheet.octopart.com/WR06X2203FTL-Walsin-Technologies-datasheet-48038251.pdf?src-supplier=Element14; ComponentLink3URL: http://www.farnell.com/datasheets/1960319.pdf?src-supplier=Newark; ComponentLink3Description: http://www.farnell.com/datasheets/1960319.pdf?src-supplier=Newark
R33 R35 = RES 0K OHM 0603: Res Thkflm 0603 0 Ohm Jumper 1/10W 100Ppm/ C Smd Rohs Compliant: Yes; Manufacturer: Stackpole Electronics; Max Power Dissipation: 100mW; Voltage Rating: 75V; Designed By: Arda B.; Supplier: Digi-Key; Supplier Part Number: RMCF0603ZT0R00CT-ND; Manufacturer Part Number: RMCF0603ZT0R00; RoHS: Yes; Category: Chip SMD Resistors; Stock: 14742163; Pricing: 1=0,1, 10=0,013, 25=0,0096, 50=0,0072, 100=0,0051, 250=0,00408, 500=0,00328, 1000=0,00241 (USD); Mounting Technology: Surface Mount; Case/Package: 0603; Case Code (Metric): 1608; Case Code (Imperial): 0603; Contact Plating: Tin,Matte; Min Operating Temperature: -55°C; Max Operating Temperature: 155°C; Packaging: Tape and Reel; Number of Terminations: 2; Features: Automotive AEC-Q200; Series: RMCF; Construction: Rectangular; Length: 1.55mm; Width: 0.031inch; Height: 0.022inch; Depth: 0.8mm; Radiation Hardening: No; Lead Free: 5697LeadFree; Military Standard: Not; RoHS Compliant: Yes; ComponentLink1URL: https://datasheet.octopart.com/RMCF0603ZT0R00-Stackpole-Electronics-datasheet-11547379.pdf?src-supplier=Future+Electronics; ComponentLink1Description: https://datasheet.octopart.com/RMCF0603ZT0R00-Stackpole-Electronics-datasheet-11547379.pdf?src-supplier=Future+Electronics; ComponentLink2URL: https://www.seielect.com/catalog/SEI-Packaging.pdf?src-supplier=Avnet; ComponentLink2Description: https://www.seielect.com/catalog/SEI-Packaging.pdf?src-supplier=Avnet; ComponentLink3URL: https://www.seielect.com/catalog/SEI-Packaging.pdf?src-supplier=Arrow+Electronics; ComponentLink3Description: https://www.seielect.com/catalog/SEI-Packaging.pdf?src-supplier=Arrow+Electronics; ComponentLink4URL: https://www.seielect.com/catalog/SEI-Packaging.pdf?src-supplier=Verical; ComponentLink4Description: https://www.seielect.com/catalog/SEI-Packaging.pdf?src-supplier=Verical; ComponentLink5URL: https://www.seielect.com/Catalog/SEI-RMCF_RMCP.pdf?src-supplier=Digi-Key; ComponentLink5Description: https://www.seielect.com/Catalog/SEI-RMCF_RMCP.pdf?src-supplier=Digi-Key; ComponentLink6URL: https://www.seielect.com/catalog/SEI-Packaging.pdf?src-supplier=Digi-Key; ComponentLink6Description: https://www.seielect.com/catalog/SEI-Packaging.pdf?src-supplier=Digi-Key; ComponentLink7URL: https://datasheet.octopart.com/RMCF0603ZT0R00-Stackpole-Electronics-datasheet-154799224.pdf?src-supplier=Master+Electronics; ComponentLink7Description: https://datasheet.octopart.com/RMCF0603ZT0R00-Stackpole-Electronics-datasheet-154799224.pdf?src-supplier=Master+Electronics
R38 = RES 100 OHM 0603: Res Thick Film 0603 100 Ohm 1% 1/10W ±100ppm/°C Molded SMD SMD Paper T/R; Manufacturer: Stackpole Electronics; Designed By: Arda B.; Power Rating: 100mW; Voltage Rating: 75V; Supplier: Digi-Key; Supplier Part Number: RMCF0603FT100RCT-ND; Manufacturer Part Number: RMCF0603FT100R; RoHS: Yes; Category: Chip SMD Resistors; Stock: 1439446; Pricing: 1=0,1, 10=0,015, 50=0,009, 100=0,0075, 500=0,00498, 1000=0,00425 (USD); Mounting Technology: Surface Mount; Case/Package: 0603; Case Code (Metric): 1608; Case Code (Imperial): 0603; Contact Plating: Tin,Matte; Min Operating Temperature: -55°C; Max Operating Temperature: 155°C; Tolerance: 1%; Packaging: Tape and Reel; Number of Terminations: 2; Max Power Dissipation: 100mW; Temperature Coefficient: 100ppm/°C; Features: Automotive AEC-Q200; Series: RMCF; Construction: Rectangular; Length: 0.061inch; Width: 0.031inch; Height: 0.022inch; Depth: 0.8mm; Ratings: AEC-Q200; Radiation Hardening: No; Military Standard: Not; Lead Free: Lead Free; RoHS Compliant: Yes; ComponentLink1URL: https://datasheet.ciiva.com/15215/getdatasheetpartid-360413-15215981.pdf?src-supplier=Verical; ComponentLink1Description: https://datasheet.ciiva.com/15215/getdatasheetpartid-360413-15215981.pdf?src-supplier=Verical
RT1 = TFPT1206L1002FM: Thermistor PTC 10K Ohm 1% 2-Pin 1206 Surface Mount Solder Pad T/R Automotive; Manufacturer: Vishay Dale; Value: 10kR; Power Rating: 125mW; Voltage: 40V; Designed By: Arda B.; Supplier: Digi-Key; Supplier Part Number: 541-3533-2-ND; Manufacturer Part Number: TFPT1206L1002FM; RoHS: Yes; Category: Thermistors; Stock: 5000; Pricing: 5000=0,49594, 10000=0,46288, 15000=0,45462 (USD); Mounting Technology: Surface Mount; Case/Package: 1206; Case Code (Imperial): 1206; Min Operating Temperature: -55°C; Max Operating Temperature: 125°C; Packaging: Tape and Reel; Package Quantity: 5000; Tolerance: 1%; Max Power Dissipation: 125mW; Termination: SMD/SMT; Series: TFPT; Resistance Tolerance: 1%; Length: 3.2mm; Width: 1.6mm; Height: 0.55mm; Lead Free: Lead Free; RoHS Compliant: Yes; ComponentLink1URL: https://datasheet.ciiva.com/2852/tfpt-2852076.pdf?src-supplier=Digi-Key; ComponentLink1Description: https://datasheet.ciiva.com/2852/tfpt-2852076.pdf?src-supplier=Digi-Key
S2 = LHI878/3902: SENSOR PYRO DETECTOR DUAL MOTION; Manufactur: Excelitas Technologies; Desihned By: Arda B.; Min Supply Voltage: 2V; Max Supply Voltage: 12V; Manufactur Produce Number: LHI 878/3902; Case/Package: Tube; Category: SENSOR PYRO DETECTOR DUAL MOTION; Pricing: $5.61000; Min Operating Temperature: -40; Max Operating Temperature: 70; Pins: 3; ComponentLink1Description: Data Sheet; ComponentLink1URL: https://www.excelitas.com/product/pyd-1388-pyd-1398-dual-element-pyros
U8 = OPA 314: IC OPAMP GP 3MHZ RRO SOT23-5; Manufacturer: Texas Instruments; Designed By: Arda B.; Supplier: Mouser; Supplier Part Number: 595-OPA314AIDBVR; Manufacturer Part Number: OPA314AIDBVR; RoHS: Yes; Category: Amplifiers - Op Amps, Buffer, Instrumentation; Stock: 24219; Pricing: 1=1,16, 10=0,982, 50=0,982, 100=0,754, 1000=0,526, 10000=0,458 (USD); ComponentLink1URL: https://datasheet.ciiva.com/29638/opa314-29638827.pdf?src-supplier=Digi-Key; ComponentLink1Description: https://datasheet.ciiva.com/29638/opa314-29638827.pdf?src-supplier=Digi-Key; ComponentLink2URL: https://datasheet.ciiva.com/14462/opa2314-14462006.pdf?src-supplier=Avnet; ComponentLink2Description: https://datasheet.ciiva.com/14462/opa2314-14462006.pdf?src-supplier=Avnet; ComponentLink3URL: https://datasheet.ciiva.com/14456/opa2314-14456281.pdf?src-supplier=Avnet; ComponentLink3Description: https://datasheet.ciiva.com/14456/opa2314-14456281.pdf?src-supplier=Avnet
U9 = NCS36000: PIR CONTROLLER NCS36000 Series Single 5.75V Passive Infrared Detector Controller (PIR) -SOIC-14; Manufacturer: ON Semiconductor; Designed By: Arda B.; Supplier: Digi-Key; Supplier Part Number: NCS36000DRGOSCT-ND; Manufacturer Part Number: NCS36000DRG; RoHS: Yes; Category: Amplifiers - Op Amps, Buffer, Instrumentation; Stock: 24232; Pricing: 1=1,19, 10=1,066, 25=1,012, 100=0,7772, 250=0,6868, 500=0,65066, 1000=0,50607 (USD); ComponentLink1URL: https://datasheet.ciiva.com/1781/ncs36000-d-1781637.pdf?src-supplier=Digi-Key; ComponentLink1Description: https://datasheet.ciiva.com/1781/ncs36000-d-1781637.pdf?src-supplier=Digi-Key; ComponentLink2URL: https://datasheet.ciiva.com/4763/ncs36000-d-89569-4763639.pdf?src-supplier=Mouser; ComponentLink2Description: https://datasheet.ciiva.com/4763/ncs36000-d-89569-4763639.pdf?src-supplier=Mouser; ComponentLink3URL: https://datasheet.ciiva.com/1781/ncs36000-d-1781638.pdf?src-supplier=Digi-Key; ComponentLink3Description: https://datasheet.ciiva.com/1781/ncs36000-d-1781638.pdf?src-supplier=Digi-Key; ComponentLink4URL: https://datasheet.ciiva.com/1781/ncs36000-d-1781639.pdf?src-supplier=Digi-Key; ComponentLink4Description: https://datasheet.ciiva.com/1781/ncs36000-d-1781639.pdf?src-supplier=Digi-Key; ComponentLink5URL: https://datasheet.ciiva.com/2965/ncs36000-d-2965212.pdf?src-supplier=Avnet; ComponentLink5Description: https://datasheet.ciiva.com/2965/ncs36000-d-2965212.pdf?src-supplier=Avnet; ComponentLink6URL: https://datasheet.ciiva.com/2966/ncs36000-d-2966525.pdf?src-supplier=Avnet; ComponentLink6Description: https://datasheet.ciiva.com/2966/ncs36000-d-2966525.pdf?src-supplier=Avnet